# Altium project Wemoled.PrjPCB
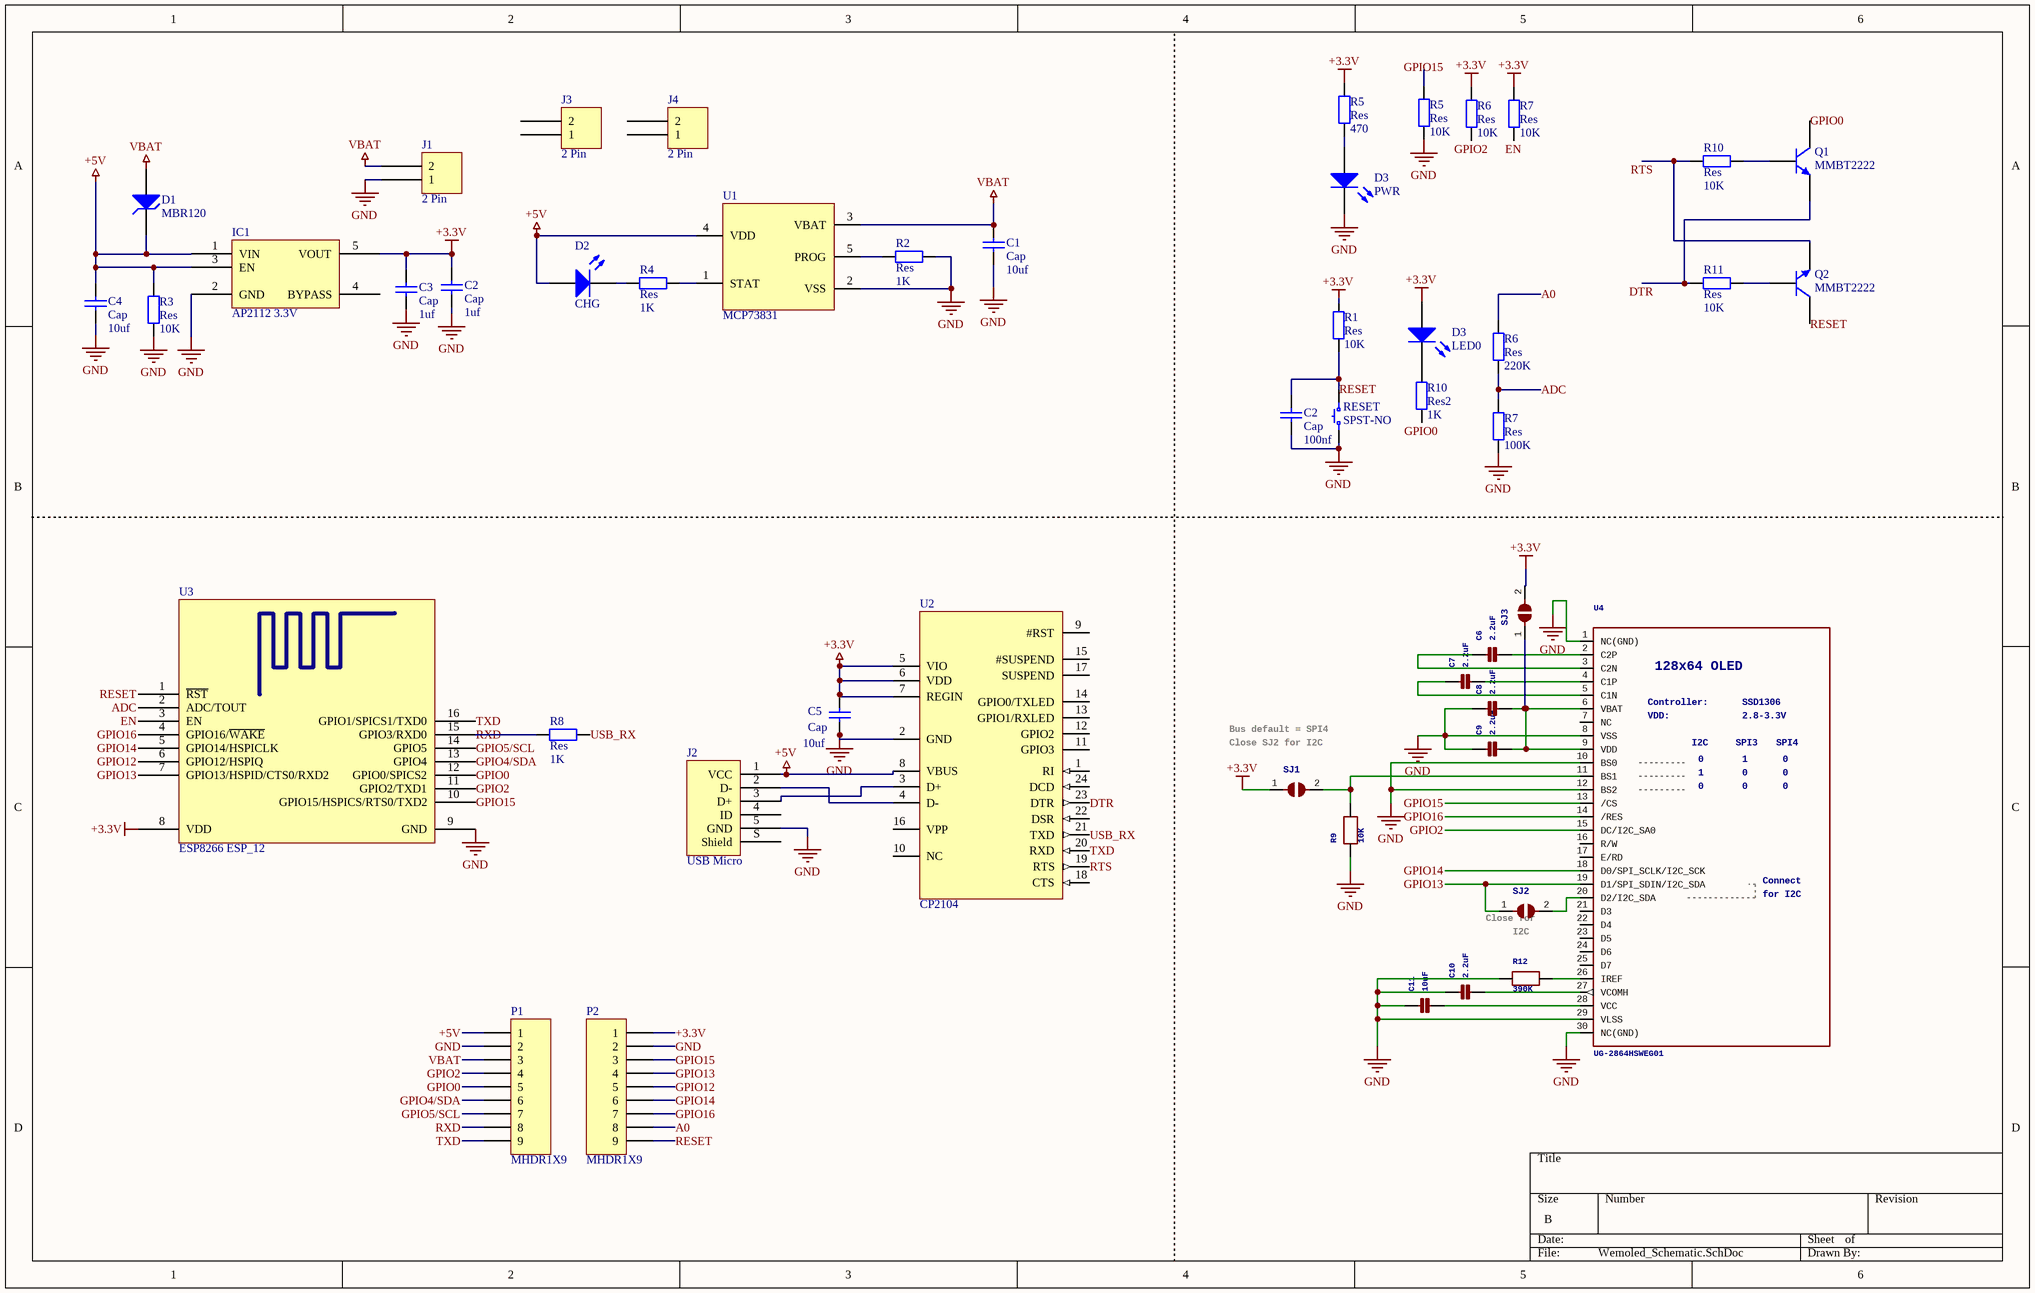
[diagram p0: Wemoled_Schematic.SchDoc]
1 sheet, 49 parts. Net scope: global (net labels, ports and power ports of the same name join across sheets).
Board file: Wemoled_PCB.PcbDoc

## Sheet Wemoled_Schematic.SchDoc: ESP8266 OLED
size B; DrawnBy: Süleyman YÜKSELDİ

### Parts
(Parts that share a designator on the sheet are numbered #1, #2 ... from top to bottom, then left to right.)
C1  Cap  value 10uf  [CAP 0805/2012]
C2#1  Cap  value 1uf  [CAP 0805/2012]
C2#2  Cap  value 100nf  [CAP 0805/2012]
C3  Cap  value 1uf  [CAP 0805/2012]
C4  Cap  value 10uf  [CAP 0805/2012]
C5  Cap  value 10uf  [CAP 0805/2012]
C6  2.2uF  [CAP 0805/2012]
C7  2.2uF  [CAP 0805/2012]
C8  2.2uF  [CAP 0805/2012]
C9  2.2uF  [CAP 0805/2012]
C10  2.2uF  [CAP 0805/2012]
C11  10uF  [CAP 0805/2012]
D1  MBR120  [SOD-123]
D2  CHG  [LED 0805/2012 RED]
D3#1  PWR  [LED 0805/2012 RED]
D3#2  LED0  [LED 0805/2012 BLUE]
IC1  AP2112 3.3V  [TI SOT-23-5 DBV]
J1  2 Pin  [JST XH B2B-XH-A]
J2  USB Micro  [FCI USB 10118193-0001LF]
J3  2 Pin  [1x2 Header_Male]
J4  2 Pin  [1x2 Header_Male]
P1  MHDR1X9  [1x9 Header_Male]
P2  MHDR1X9  [1x9 Header_Male]
Q1  MMBT2222  [DIODES SOT-23-3]
Q2  MMBT2222  [DIODES SOT-23-3]
R1  Res  value 10K  [RES 0805/2012]
R2  Res  value 1K  [RES 0805/2012]
R3  Res  value 10K  [RES 0805/2012]
R4  Res  value 1K  [RES 0805/2012]
R5#1  Res  value 470  [RES 0805/2012]
R5#2  Res  value 10K  [RES 0805/2012]
R6#1  Res  value 10K  [RES 0805/2012]
R6#2  Res  value 220K  [RES 0805/2012]
R7#1  Res  value 10K  [RES 0805/2012]
R7#2  Res  value 100K  [RES 0805/2012]
R8  Res  value 1K  [RES 0805/2012]
R9  10K  [RES 0805/2012]
R10#1  Res  value 10K  [RES 0805/2012]
R10#2  Res2  value 1K  [RES 0805/2012]
R11  Res  value 10K  [RES 0805/2012]
R12  390K  [RES 0805/2012]
RESET  SPST-NO  [SW_TL3342F160QG]
SJ1  SOLDERJUMPERREFLOW_NOPASTE  [Solder Jumper]  (value not drawn)
SJ2  SOLDERJUMPERREFLOW_NOPASTE  [Solder Jumper]  (value not drawn)
SJ3  SOLDERJUMPERREFLOW_NOPASTE  [1x2 Header_Male(Jumper)]  (value not drawn)
U1  MCP73831  [TI SOT-23-5 DBV]
U2  CP2104  [SMSC QFN-24 4x4MM]
U3  ESP8266 ESP_12  [ESP8266 ESP_12]
U4  UG-2864HSWEG01  128x64OLED: 128x64 OLED  forI2C: for I2C  Controller: Controller:  VDD: VDD:  [OLED 64*128]

### Nets
+3.3V: C2#1.2 C3.2 C5.2 D3#2.1(A) IC1.5(VOUT) P2.1 R1.2 R5#1.1 R6#1.1 R7#1.1 SJ1.1 SJ3.2 U2.5(VIO) U2.6(VDD) U2.7(REGIN) U3.8(VDD)
+5V: C4.2 D1.2(K) D2.1(A) IC1.1(VIN) IC1.3(EN) J2.1(VCC) P1.1 R3.2 U1.4(VDD) U2.8(VBUS)
GND: C1.1 C2#1.1 C2#2.1 C3.1 C4.1 C5.1 C8.1(P$1) C9.1(P$1) C10.1(P$1) C11.1(P$1) D3#1.2(K) IC1.2(GND) J1.1 J2.5(GND) P1.2 P2.2 R2.1 R3.1 R5#2.2 R7#2.2 R9.1 R12.1 RESET.1 U1.2(VSS) U2.2(GND) U3.9(GND) U4.1(NC(GND)) U4.8(VSS) U4.10(BS0) U4.12(BS2) U4.29(VLSS) U4.30(NC(GND))
VBAT: C1.2 D1.1(A) J1.2 P1.3 U1.3(VBAT)
A0: P2.8 R6#2.1
ADC: R6#2.2 R7#2.1 U3.2(ADC/TOUT)
DTR: Q1.3(E) R11.2 U2.23(DTR)
EN: R7#1.2 U3.3(EN)
GPIO0: P1.5 Q1.1(C) R10#2.1 U3.12(GPIO0/SPICS2)
GPIO2: P1.4 R6#1.2 U3.11(GPIO2/TXD1) U4.15(DC/I2C_SA0)
GPIO4/SDA: P1.6 U3.13(GPIO4)
GPIO5/SCL: P1.7 U3.14(GPIO5)
GPIO12: P2.5 U3.6(GPIO12/HSPIQ)
GPIO13: P2.4 SJ2.1 U3.7(GPIO13/HSPID/CTS0/RXD2) U4.19(D1/SPI_SDIN/I2C_SDA)
GPIO14: P2.6 U3.5(GPIO14/HSPICLK) U4.18(D0/SPI_SCLK/I2C_SCK)
GPIO15: P2.3 R5#2.1 U3.10(GPIO15/HSPICS/RTS0/TXD2) U4.13(/CS)
GPIO16: P2.7 U3.4(GPIO16/~{WAKE}) U4.14(/RES)
RESET: C2#2.2 P2.9 Q2.1(C) R1.1 RESET.3 U3.1(~{RST})
RTS: Q2.3(E) R10#1.2 U2.19(RTS)
RXD: P1.8 R8.2 U3.15(GPIO3/RXD0)
TXD: P1.9 U2.20(RXD) U3.16(GPIO1/SPICS1/TXD0)
USB_RX: R8.1 U2.21(TXD)
NetC6_1: C6.1(P$1) U4.3(C2N)
NetC6_2: C6.2(P$2) U4.2(C2P)
NetC7_1: C7.1(P$1) U4.5(C1N)
NetC7_2: C7.2(P$2) U4.4(C1P)
NetC8_2: C8.2(P$2) C9.2(P$2) SJ3.1 U4.6(VBAT) U4.9(VDD)
NetC10_2: C10.2(P$2) U4.27(VCOMH)
NetC11_2: C11.2(P$2) U4.28(VCC)
NetD2_2: D2.2(K) R4.2
NetD3#1_1: D3#1.1(A) R5#1.2
NetD3#2_2: D3#2.2(K) R10#2.2
NetJ2_2: J2.2(D-) U2.4(D-)
NetJ2_3: J2.3(D+) U2.3(D+)
NetQ1_2: Q1.2(B) R10#1.1
NetQ2_2: Q2.2(B) R11.1
NetR2_2: R2.2 U1.5(PROG)
NetR4_1: R4.1 U1.1(STAT)
NetR9_2: R9.2 SJ1.2 U4.11(BS1)
NetR12_2: R12.2 U4.26(IREF)
NetSJ2_2: SJ2.2 U4.20(D2/I2C_SDA)

Not connected (* = marked no-connect by the designer): IC1 4(BYPASS); J2 4(ID) S(Shield); J3 1 2; J4 1 2; U2 1(RI) 9(#RST) 10(NC) 11(GPIO3) 12(GPIO2) 13(GPIO1/RXLED) 14(GPIO0/TXLED) 15(#SUSPEND) 16(VPP) 17(SUSPEND) 18(CTS) 22(DSR) 24(DCD); U4 7(NC) 16(R/W) 17(E/RD) 21(D3) 22(D4) 23(D5) 24(D6) 25(D7)

### Notes on the sheet
- Bus default = SPI4
- (near SJ1) Close SJ2 for I2C
- (near SJ2) Close for
- (near SJ2) I2C

### Library data of the parts
C1 C2#1 C2#2 C3-C5 = Cap: Capacitor; Published: 8-Jun-2000; LatestRevisionDate: 17-Jul-2002; LatestRevisionNote: Re-released for DXP Platform.; PackageReference: RAD-0.3; Publisher: Altium Limited; PackageDescription: Radial Cap, Thru-Hole; 2 Leads; 0.3 in Pin Spacing
C6-C11 = CAP_CERAMIC0805: Ceramic Capacitors0402 - 0402 Surface Mount Capacitors 0603 - 0603 Surface Mount Capacitors 0603 - RF Specific 0805 - 0805 Surface Mount Capacitors 1206 - 1206 Surface Mount Capacitors; GateName_1: G$1; DeviceName: 0805; SymbolName_1: CAPACITOR; LibraryName: microbuilder; DeviceSetName: CAP_CERAMIC
D1 = D Zener: Zener Diode; Published: 8-Jun-2000; LatestRevisionDate: 17-Jul-2002; LatestRevisionNote: Re-released for DXP Platform.; PackageReference: DIODE-0.7; Publisher: Altium Limited; PackageDescription: Diode, Thru-Hole; 2 Leads; 0.7 in Pin Spacing
D2 D3#1 D3#2 = LED0: Typical INFRARED GaAs LED; Published: 8-Jun-2000; LatestRevisionDate: 08-Jul-2005; LatestRevisionNote: Mech Layer 1 removed.; PackageReference: LED-0; Publisher: Altium Limited; PackageDescription: LED; 2 Leads
IC1 = TI LP3985: Micropower 150mA Low-Noise Ultra Low-Dropout CMOS Voltage Regulator
J2 = USB 2.0 Type B Micro
P1 P2 = MHDR1X9: Header, 9-Pin; LatestRevisionDate: 17-Jul-2002; LatestRevisionNote: Re-released for DXP Platform.; Publisher: Altium Limited
Q1 Q2 = NPN: NPN Bipolar Transistor; Published: 8-Jun-2000; LatestRevisionDate: 17-Jul-2002; LatestRevisionNote: Re-released for DXP Platform.; PackageReference: TO-226-AA; Publisher: Altium Limited; PackageDescription: TO, Flat Index; 3 In-Line, Axial Leads; Body Dia. 4.8mm; Leads 0.55 x 0.51 mm (max); Code_JEDEC: TO-226-AA
R1-R4 R5#1 R5#2 R6#1 R6#2 R7#1 R7#2 R8 R10#1 R10#2 R11 = Res2: Resistor; Published: 8-Jun-2000; LatestRevisionDate: 17-Jul-2002; LatestRevisionNote: Re-released for DXP Platform.; PackageReference: AXIAL-0.4; Publisher: Altium Limited; PackageDescription: Axial Device, Thru-Hole; 2 Leads; 0.4 in Pin Spacing
R9 R12 = RESISTOR0805: Resistors0402 - 0402 Surface Mount Package 0603 - 0603 Surface Mount Package0805 - 0805 Surface Mount Package 1206 - 1206 Surface Mount Package2012 - 2010 Surface Mount Package; GateName_1: G$1; DeviceName: 0805; SymbolName_1: RESISTOR; LibraryName: microbuilder; DeviceSetName: RESISTOR
RESET = NKK AB11AH-HA
SJ1-SJ3 = SOLDERJUMPERREFLOW_NOPASTE: SMD Solder JUMPERSolder the two pads together to create a connection, or remove the solder to break it.REFLOW - Use this footprint for solder paste and reflow ovens.WAVE - Use this footprint for hand-soldering (larger pads). CLOSED - Has a trace between the two pads to ensure it is closed by default.  The trace needs to be cut to disable the jumper, and can be closed again by creating a solder bridge between the two pads.; GateName_1: 1; SymbolName_1: SOLDERJUMPER; DeviceName: REFLOW_NOPASTE; LibraryName: microbuilder; DeviceSetName: SOLDERJUMPER
U3 = ESP8266 ESP_12: ESP8266 ESP-12; IC: ESP8266-EX; Vendor: Ai-thinker; LatestReviewer: Zion Blue; Published: 14-Apr-2015; Publisher: Cynetik Group; LatestRevisionData: 14-Apr-2015; LatestRevisionNote: Include 3D body and Footprint
U4 = DISP_OLED_UG-2864HSWEG01: UG-2864HSWEG01 OLED display Both 1.3" and 0.96" models share the same FPC tab footprint, only the screen dimensions vary.; GateName_1: G$1; SymbolName_1: UG-2864HSWEG01; LibraryName: microbuilder; DeviceSetName: DISP_OLED_UG-2864HSWEG01; I2C: I2C; SPI3: SPI3; 0: 0; 1: 1; Connect: Connect; SSD1306: SSD1306; 2.8-3.3V: 2.8-3.3V; SPI4: SPI4